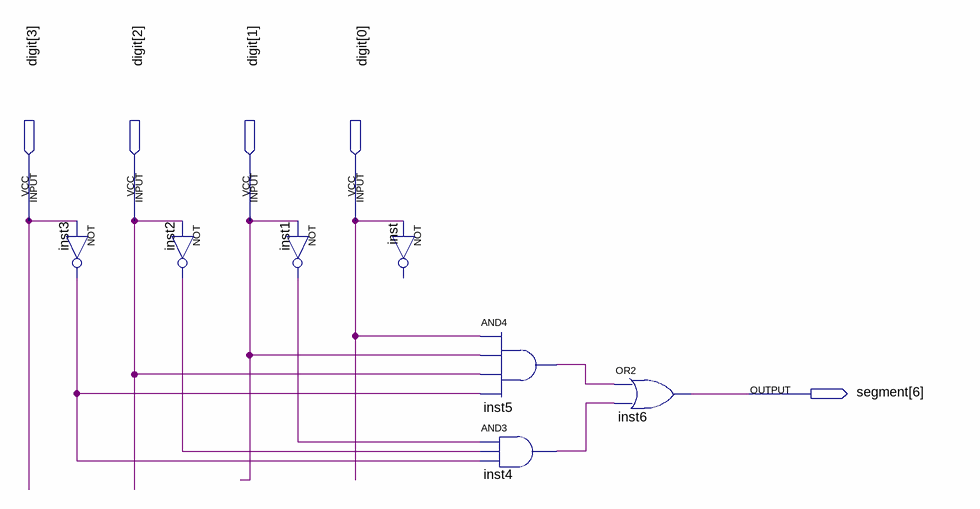
[diagram p0: schematic sheet]
// Quartus schematic segmentG.bdf as structural Verilog: 7 symbols, 5 pins
module segmentG (
  input  [3:0] digit,
  output [6:6] segment
);

  wire inst1_out, inst2_out, inst3_out, inst4_out, inst5_out;

  not inst3 (inst3_out, digit[3]);
  not inst2 (inst2_out, digit[2]);
  not inst1 (inst1_out, digit[1]);
  // NOT inst has open pins: IN=digit[0], OUT=open
  and inst5 (inst5_out, digit[0], digit[1], digit[2], inst3_out);
  and inst4 (inst4_out, inst1_out, inst2_out, inst3_out);
  or inst6 (segment[6], inst5_out, inst4_out);
endmodule
